# Altium project dog_scale_pcb.PrjPcb
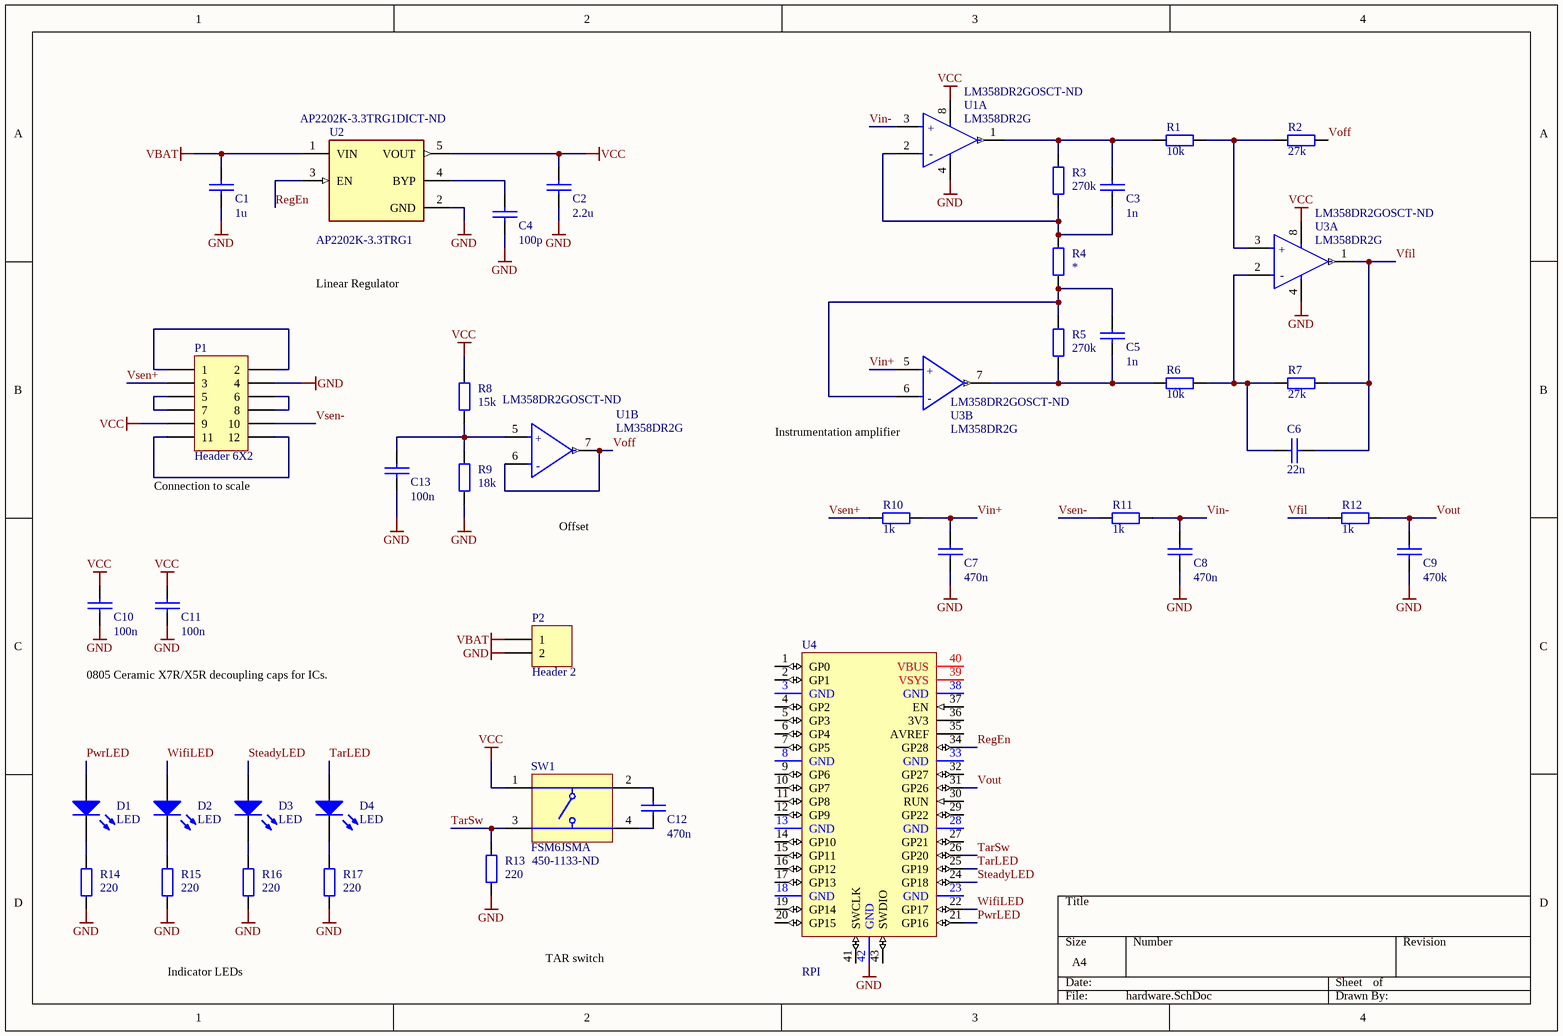
[diagram p0: hardware.SchDoc]
1 sheet, 41 parts. Net scope: global (net labels, ports and power ports of the same name join across sheets).
Board file: pcb.PcbDoc

## Sheet hardware.SchDoc
size A4; SheetNumber: 1; SheetTotal: 1

### Parts
C1  1u  [C0805]
C2  2.2u  [C0805]
C3  1n  [C0805]
C4  100p  [C0805]
C5  1n  [C0805]
C6  22n  [C0805]
C7  470n  [C0805]
C8  470n  [C0805]
C9  470k  [C0805]
C10  100n  [C0805]
C11  100n  [C0805]
C12  470n  [C0805]
C13  100n  [C0805]
D1  LED  [LED0805]
D2  LED  [LED0805]
D3  LED  [LED0805]
D4  LED  [LED0805]
P1  Header 6X2  [HDR2X6]
P2  Header 2  [HDR1X2]
R1  10k  [R0805]
R2  27k  [R0805]
R3  270k  [R0805]
R4  *  [R0805]
R5  270k  [R0805]
R6  10k  [R0805]
R7  27k  [R0805]
R8  15k  [R0805]
R9  18k  [R0805]
R10  1k  [R0805]
R11  1k  [R0805]
R12  1k  [R0805]
R13  220  [R0805]
R14  220  [R0805]
R15  220  [R0805]
R16  220  [R0805]
R17  220  [R0805]
SW1  FSM6JSMA  Supplier Part Number 1: 450-1133-ND  [TECO-FSM6JSMA_V]
U1  LM358DR2G  Supplier Part Number 1: LM358DR2GOSCT-ND  [FP-751-07-IPC_C]  (parts A,B of 2)
U2  AP2202K-3.3TRG1  Supplier Part Number 1: AP2202K-3.3TRG1DICT-ND  [FP-SOT25-MFG]
U3  LM358DR2G  Supplier Part Number 1: LM358DR2GOSCT-ND  [FP-751-07-IPC_C]  (parts A,B of 2)
U4  RPI  [RPI-PICO-MOD]

### Nets
GND: C1.1 C2.1 C4.1 C7.1 C8.1 C9.1 C10.1 C11.1 C13.1 P1.4 P2.2 R9.1 R13.1 R14.1 R15.1 R16.1 R17.1 U1.4(VEE/GND) U2.2(GND) U3.4(VEE/GND) U4.42(GND)
VBAT: C1.2 P2.1 U2.1(VIN)
VCC: C2.2 C10.2 C11.2 P1.9 R8.2 SW1.1 U1.8(VCC) U2.5(VOUT) U3.8(VCC)
PwrLED: D1.1(A) U4.21(GP16)
RegEn: U2.3(EN) U4.34(GP28)
SteadyLED: D3.1(A) U4.24(GP18)
TarLED: D4.1(A) U4.25(GP19)
TarSw: R13.2 SW1.3 U4.26(GP20)
Vfil: C6.1 R7.1 R12.2 U3.1(OUTPUT_A)
Vin+: C7.2 R10.1 U3.5(INPUT_B+)
Vin-: C8.2 R11.1 U1.3(INPUT_A+)
Voff: R2.1 U1.6(INPUT_B-) U1.7(OUTPUT_B)
Vout: C9.2 R12.1 U4.31(GP26)
Vsen+: P1.3 R10.2
Vsen-: P1.10 R11.2
WifiLED: D2.1(A) U4.22(GP17)
NetC3_1: C3.1 R3.1 R4.2 U1.2(INPUT_A-)
NetC3_2: C3.2 R1.2 R3.2 U1.1(OUTPUT_A)
NetC4_2: C4.2 U2.4(BYP)
NetC5_1: C5.1 R5.1 R6.2 U3.7(OUTPUT_B)
NetC5_2: C5.2 R4.1 R5.2 U3.6(INPUT_B-)
NetC6_2: C6.2 R6.1 R7.2 U3.2(INPUT_A-)
NetC12_1: C12.1 SW1.4
NetC12_2: C12.2 SW1.2
NetC13_2: C13.2 R8.1 R9.2 U1.5(INPUT_B+)
NetD1_2: D1.2(K) R14.2
NetD2_2: D2.2(K) R15.2
NetD3_2: D3.2(K) R16.2
NetD4_2: D4.2(K) R17.2
NetP1_1: P1.1 P1.2
NetP1_5: P1.5 P1.7
NetP1_6: P1.6 P1.8
NetP1_11: P1.11 P1.12
NetR1_1: R1.1 R2.2 U3.3(INPUT_A+)

Not connected (* = marked no-connect by the designer): U4 1(GP0) 2(GP1) 3(GND) 4(GP2) 5(GP3) 6(GP4) 7(GP5) 8(GND) 9(GP6) 10(GP7) 11(GP8) 12(GP9) 13(GND) 14(GP10) 15(GP11) 16(GP12) 17(GP13) 18(GND) 19(GP14) 20(GP15) 23(GND) 27(GP21) 28(GND) 29(GP22) 30(RUN) 32(GP27) 33(GND) 35(AVREF) 36(3V3) 37(EN) 38(GND) 39(VSYS) 40(VBUS) 41(SWCLK) 43(SWDIO)

### Notes on the sheet
- Linear Regulator
- (near U3) Instrumentation amplifier
- (near P1) Connection to scale
- Offset
- 0805 Ceramic X7R/X5R decoupling caps for ICs.
- Indicator LEDs
- TAR switch
- (in symbol CMP-1310-00291-2, part A) +
- (in symbol CMP-1310-00291-2, part B) +

### Library data of the parts
C1-C13 = CCAP0805
  C1: Value: 1u
  C2: Value: 2.2u
  C3 C5: Value: 1n
  C4: Value: 100p
  C6: Value: 22n
  C7 C8 C12: Value: 470n
  C9: Value: 470k
  C10 C11 C13: Value: 100n
P1 = Header 6X2: Header, 6-Pin, Dual row; LatestRevisionDate: 17-Jul-2002; LatestRevisionNote: Re-released for DXP Platform.; Publisher: Altium Limited
P2 = Header 2: Header, 2-Pin; LatestRevisionDate: 17-Jul-2002; LatestRevisionNote: Re-released for DXP Platform.; Publisher: Altium Limited
R1-R17 = RES0805
  R1 R6: Value: 10k
  R2 R7: Value: 27k
  R3 R5: Value: 270k
  R4: Value: *
  R8: Value: 15k
  R9: Value: 18k
  R10-R12: Value: 1k
  R13-R17: Value: 220
SW1 = CMP-2000-07503-1: Switch, SPST, 24 V, -35 to 85 degC, 4-Pin SMD, RoHS, Tape and Reel; Manufacturer: TE Connectivity; Electrical Life: 100000Cycles; Voltage Rating (DC): 24V; Contact Resistance: 100mOhm; Case\/Package: SMD/SMT; Actuator Length: 3.4mm; Contact Current Rating: 50mA; Operating Force: 1.57N; Max Voltage Rating (DC): 12V; Illumination Type: Illuminated; Actuator Material: Polyamide; Switch Travel: 0.25mm; Switch Function: Off-Mom; Actuator Type: Standard; Contact Plating: Silver; Mount: SurfaceMount; Contact Material: CopperAlloy; RoHSCompliant: true; Width: 6mm; Package Reference: FSM6JSMA; Manufacturer URL: http://www.te.com/; Min Operating Temperature: -35degC; REACH SVHC: Unknown; Datasheet Version: Rev. V, 02/2015; Package Quantity: 750; Voltage Rating: 24V; Termination: GullWing; Mechanical Life: 100000Cycles; Mounting Technology: SurfaceMount; Insulation Resistance: 100MOhm; Packaging: LoosePiece; Package Description: 4-Pin Surface Mount Device, Body 6 x 6 mm, Pitch 4.5 mm; Orientation: Straight; Max Operating Temperature: 85degC; Length: 6mm; Current Rating: 50mA; Datasheet URL: http://www.te.com/commerce/DocumentDelivery/DDEController?Action=showdoc&DocId=Customer+Drawing%7F2-1437565-7%7FV%7Fpdf%7FEnglish%7FENG_CD_2-1437565-7_V.pdf%7F4-1437565-9; Lead Free: LeadFree; ELV: Compliant; Throw Configuration: SPST; Supplier 1: Digi-Key; Manufacturer Part Number: FSM6JSMA; RoHS: Yes; Category: Uncategorized; Stock 1: 22985; Pricing 1: 1=0.35000, 10=0.33500, 25=0.31560, 100=0.27390, 250=0.24852, 500=0.23116, 1000=0.20805, 2500=0.19534, 5000=0.18147 (USD); Series: FSMJSMA; Max Current Rating: 50mA; Type: Switch; Depth: 10mm; Radiation Hardening: No; RoHS Compliant: Yes
U1 U3 = CMP-1310-00291-2: IC OPAMP GP 2 CIRCUIT 8SOIC; Manufacturer: ON Semiconductor; Gain Bandwidth Product: 1MHz; Number of Circuits: 2; Min Supply Voltage: 3V; Slew Rate: 0.6V/µs; Max Dual Supply Voltage: 16V; Common Mode Rejection Ratio: 65dB; Input Bias Current: 250nA; Min Dual Supply Voltage: 1.5V; Dual Supply Voltage: 9V; Operating Supply Current: 1.5mA; Output Current: 40mA; Input Offset Voltage (Vos): 7mV; Nominal Supply Current: 1.2mA; Voltage Gain: 100dB; Max Supply Voltage: 32V; Amplifier Type: GENERAL PURPOSE; Channel Separation: -120dB; Width: 4mm; Number of Pins: 8; Min Operating Temperature: 0°C; REACH SVHC: No SVHC; Contact Plating: Tin; Lead Free: Lead Free; Halogen Free: Halogen Free; Power Supply Rejection Ratio (PSRR): 65dB; Operating Supply Voltage: 16V; Package Quantity: 2500; Max Operating Temperature: 70°C; Case/Package: SOIC; Height: 1.5mm; Packaging: Tape and Reel; Radiation Hardening: No; Number of Channels: 2; Bandwidth: 1MHz; Length: 5mm; Number of Elements: 2; Number of Amplifiers: 2; Output Current per Channel: 40mA; Supplier 1: Digi-Key; Manufacturer Part Number: LM358DR2G; RoHS: Yes; Category: Amplifiers - Op Amps, Buffer, Instrumentation; Stock 1: 86894; Pricing 1: 1=0.48000, 10=0.38600, 25=0.35320, 100=0.26290, 250=0.23824, 500=0.19716, 1000=0.14787 (USD); Technology: BIPOLAR; Series: -; Supply Current: 1.2mA; RoHS Compliant: Yes; Reach SVHC Compliant: Yes
U2 = CMP-12756-000010-1: IC REG LINEAR 3.3V 150MA SOT23-5; Manufacturer: Diodes Inc.; Max Junction Temp: +125°C; Max Supply Voltage: 13.2V; Standoff Height: 0.013mm; Dropout Voltage: 165mV; Nominal Supply Current: 95-1300uA; Accuracy Percentage: 1%; Min Supply Voltage: 2.5V; Output Type: Fixed; Number Of Outputs: 1; Quiescent Current: 130uA; Polarity: Positive; Power Supply Rejection Ratio (PSRR): 75dB; RoHS: TRUE; Category: IC; Digikey Description: IC REG LINEAR 3.3V 150MA SOT23-5; ComponentLink2URL: https://www.diodes.com/assets/Datasheets/AP2202.pdf; Manufacturer Part Number: AP2202K-3.3TRG1; Lead Free: Yes; Octopart: https://octopart.com/ap2202k-3.3trg1-diodes+inc.-30954618; ComponentLink2Description: Datasheet; Temperature Range High: +125°C; Ipc Land Pattern Name: SOT95P280X115-5; Mouser Description: LDO Voltage Regulators 150mA CMOS LDO 3.3V; Temperature: -40°C to +125°C; Output Current: 150mA; Package: SOT25; Automotive: No; Temperature Range Low: -40°C; Height: 1.4mm; Device Class L2: Power Management ICs; Device Class L3: Voltage Regulators - Linear; Device Class L1: Integrated Circuits (ICs); Output Voltage: 3.3V; Footprint Url: https://www.diodes.com/assets/Package-Files/SOT25.pdf; Supplier 1: Digi-Key; Stock 1: 55855; Pricing 1: 1=0.46000, 10=0.34300, 25=0.30880, 100=0.21350, 250=0.17976, 500=0.14606, 1000=0.11236 (USD); Mount: Surface Mount; Case/Package: SOT-23-5; Number of Pins: 5; Weight: 0.001058oz; Min Operating Temperature: -40°C; Max Operating Temperature: 125°C; Packaging: Tape and Reel; Number of Regulators: 1; Package Quantity: 1; Min Input Voltage: 2.5V; Max Input Voltage: 13.2V; Max Output Current: 150mA; Accuracy: 1%; Length: 3.02mm; Width: 1.7mm; RoHS Compliant: Yes; ComponentLink1URL: https://datasheet.ciiva.com/30016/ap2202-30016782.pdf?src-supplier=Avnet; ComponentLink1Description: https://datasheet.ciiva.com/30016/ap2202-30016782.pdf?src-supplier=Avnet; ComponentLink3URL: https://datasheet.ciiva.com/29568/ap2202-29568315.pdf?src-supplier=Digi-Key; ComponentLink3Description: https://datasheet.ciiva.com/29568/ap2202-29568315.pdf?src-supplier=Digi-Key; ComponentLink4URL: https://datasheet.ciiva.com/29568/ap2202-29568316.pdf?src-supplier=Digi-Key; ComponentLink4Description: https://datasheet.ciiva.com/29568/ap2202-29568316.pdf?src-supplier=Digi-Key; ComponentLink5URL: https://datasheet.ciiva.com/29568/ap2202-29568314.pdf?src-supplier=Digi-Key; ComponentLink5Description: https://datasheet.ciiva.com/29568/ap2202-29568314.pdf?src-supplier=Digi-Key